# Altium schematic sheet 3_Cambridge_Measurement_TOP.SchDoc: Perovskite Solar Cells Analyzer
size 420 x 297 mm; CheckedBy: -; CompanyName: PoliSpace; DrawnBy: Daidone Luca; Organization: PoliSpace; Address1: Politecnico di Milano; Revision: -; SheetNumber: 1; SheetTotal: 1; Projet: 6S CubeSat - Payload; ModifiedBy: -; CreateDate: XX/XX/XXXX; CheckedDate: -; Title2: Circuit; DivGrp: EPS; Designer: Daidone Luca; ModifiedDate: -
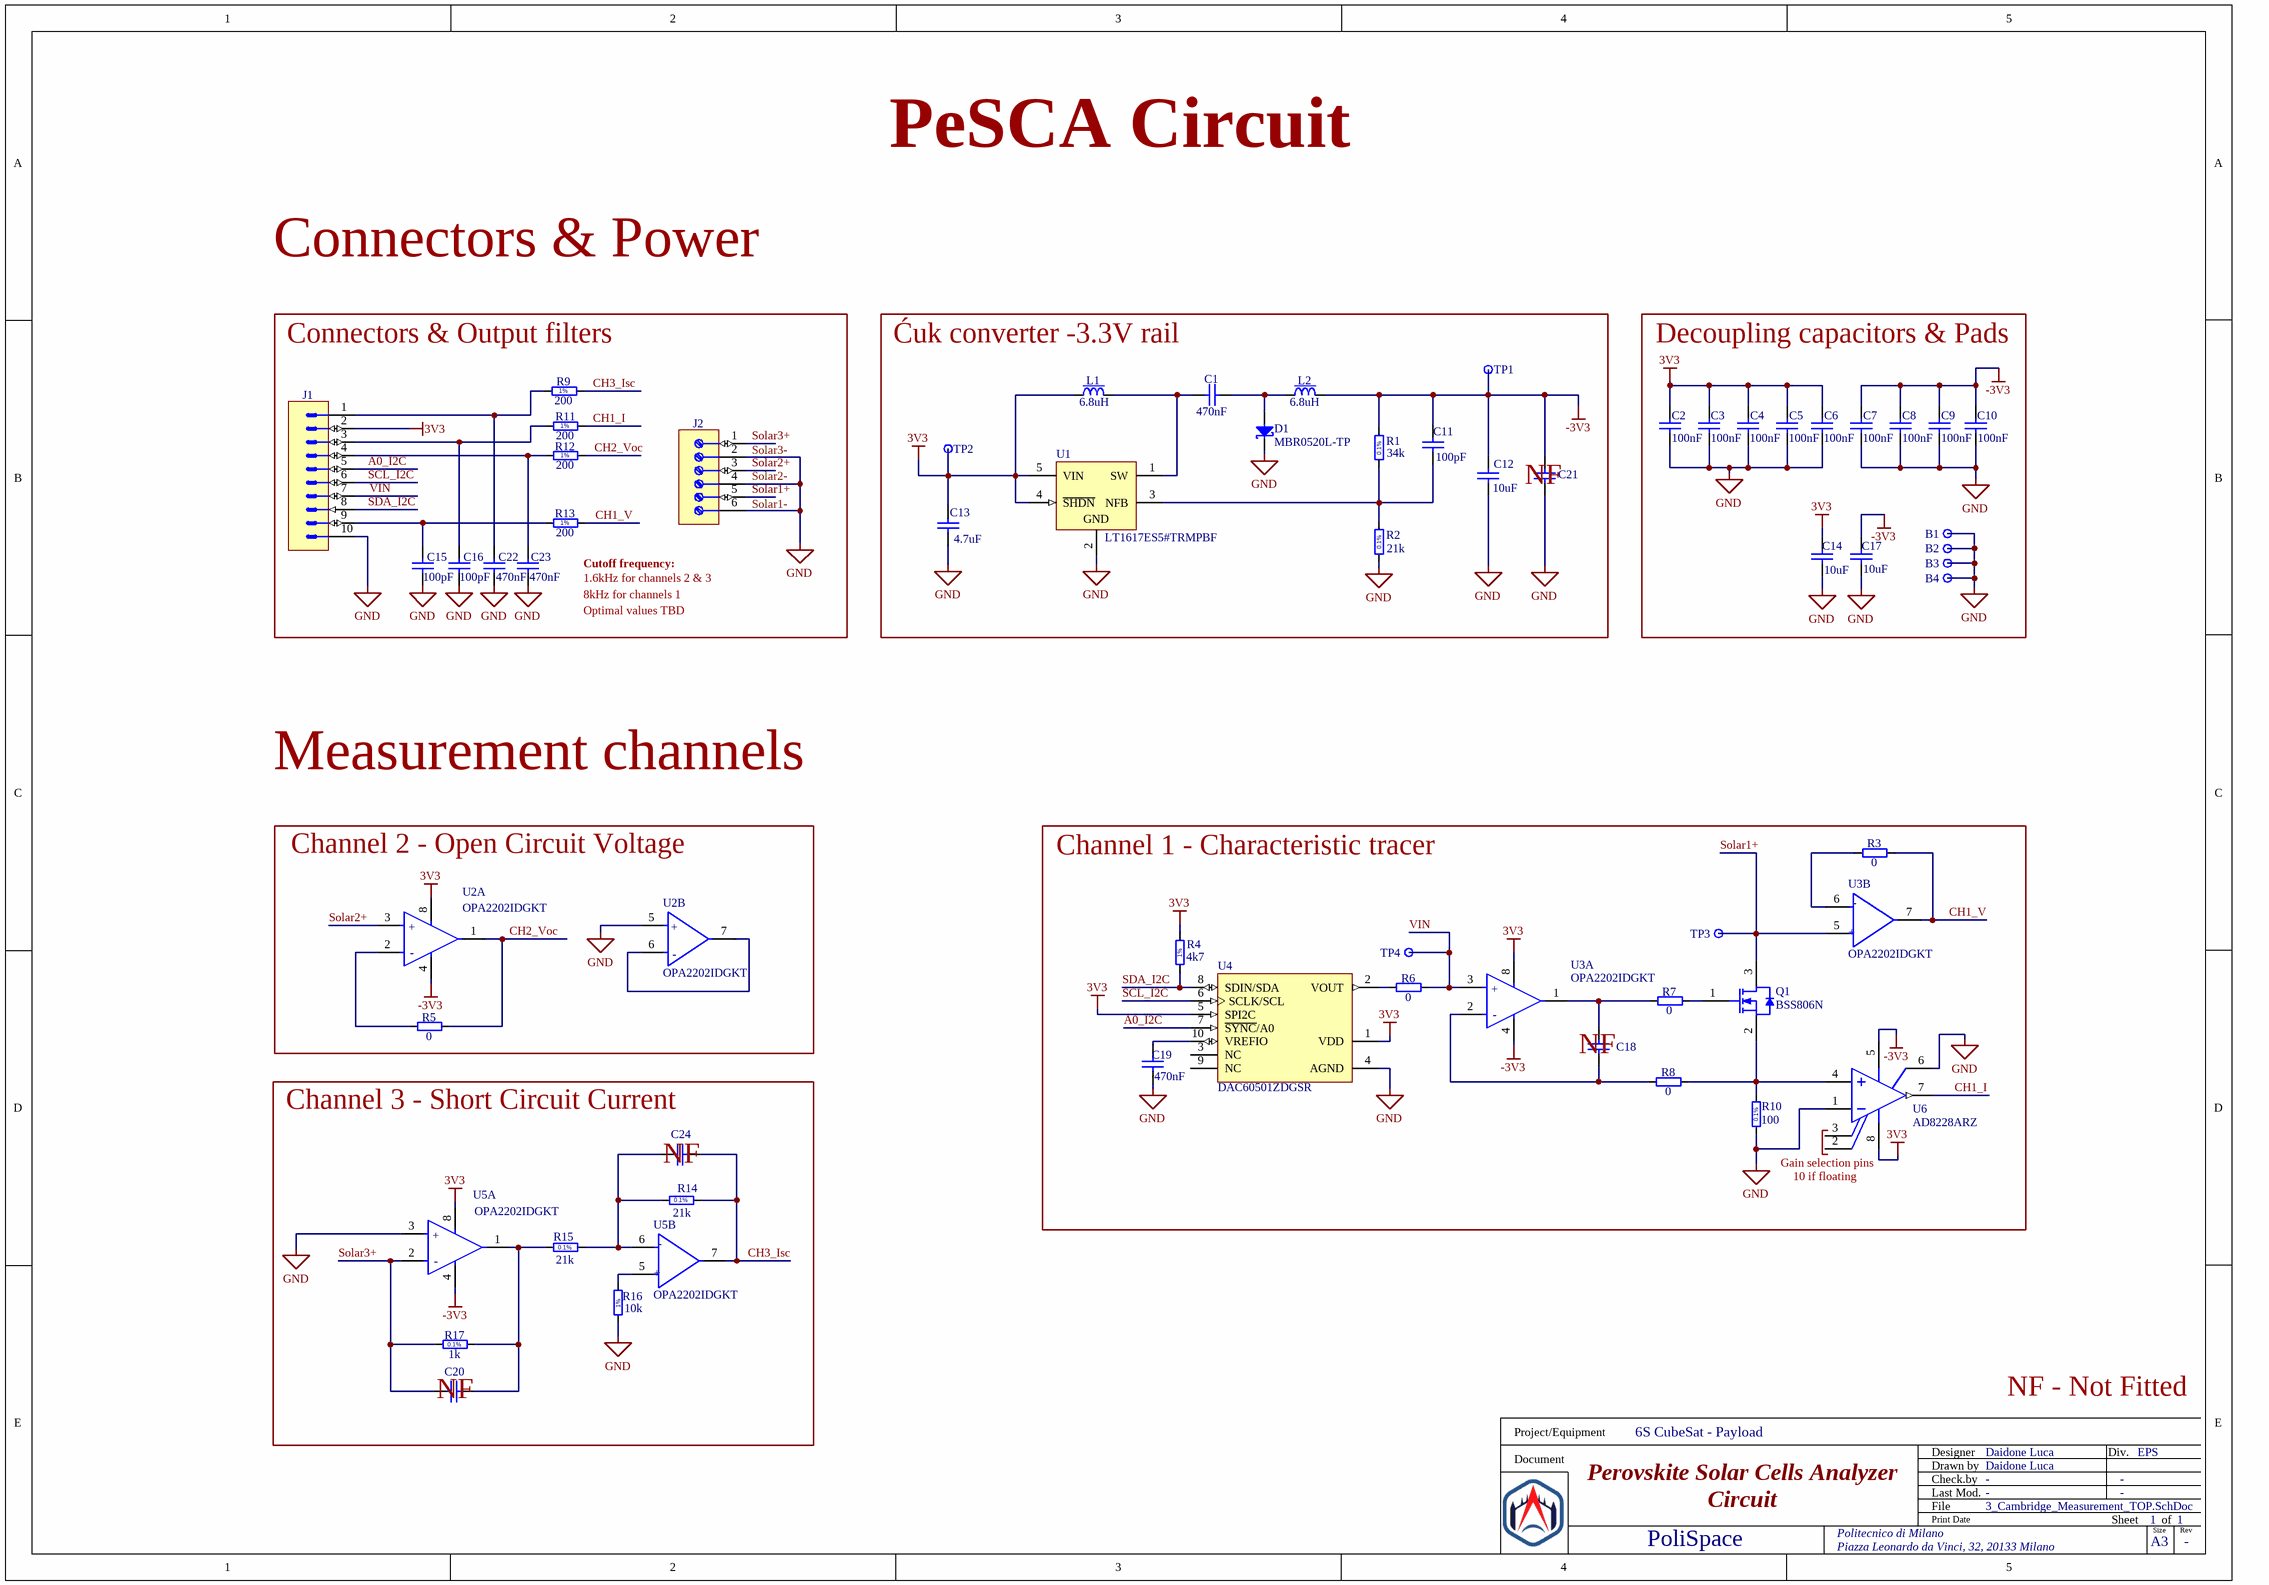
[diagram p0: 3_Cambridge_Measurement_TOP.SchDoc]

## Parts
B1  Plated Hole  [MTG350_650]  (value not drawn)  (no BOM)
B2  Plated Hole  [MTG350_650]  (value not drawn)  (no BOM)
B3  Plated Hole  [MTG350_650]  (value not drawn)  (no BOM)
B4  Plated Hole  [MTG350_650]  (value not drawn)  (no BOM)
C1  470nF  [CAPC1608X87N]
C2  100nF  [CAPC1608X87N]
C3  100nF  [CAPC1608X87N]
C4  100nF  [CAPC1608X87N]
C5  100nF  [CAPC1608X87N]
C6  100nF  [CAPC1608X87N]
C7  100nF  [CAPC1608X87N]
C8  100nF  [CAPC1608X87N]
C9  100nF  [CAPC1608X87N]
C10  100nF  [CAPC1608X87N]
C11  100pF  [CAPC1608X87N]
C12  10uF  [CAPC1608X80N]
C13  4.7uF  [CAPC1709X95N]
C14  10uF  [CAPC1608X80N]
C15  100pF  [CAPC1608X87N]
C16  100pF  [CAPC1608X87N]
C17  10uF  [CAPC1608X80N]
C18  100nF  [CAPC1608X87N]  (value not drawn)
C19  470nF  [CAPC1608X87N]
C20  100nF  [CAPC1608X87N]  (value not drawn)
C21  10uF  [CAPC2012X135N]  (value not drawn)
C22  470nF  [CAPC1608X87N]
C23  470nF  [CAPC1608X87N]
C24  100nF  [CAPC1608X87N]  (value not drawn)
D1  MBR0520L-TP  [SOD3715X135N]
J1  Header 10  [HARWIN_M20-9980546]  (value not drawn)
J2  (no value)  [PHOENIX_1725698]
L1  6.8uH  [IND_TDK_VLCF5020-1]
L2  6.8uH  [IND_TDK_VLCF5020-1]
Q1  BSS806N  [INF-PG-SOT23_M]
R1  34k  [RESC1608X55N]
R2  21k  [RESC1608X55N]
R3  0  [RESC1608X55N]
R4  4k7  [RESC1608X55N]
R5  0  [RESC1608X55N]
R6  0  [RESC1608X55N]
R7  0  [RESC1608X55N]
R8  0  [RESC1608X55N]
R9  200  [RESC1608X55N]
R10  100  [RESC1608X55N]
R11  200  [RESC1608X55N]
R12  200  [RESC1608X55N]
R13  200  [RESC1608X55N]
R14  21k  [RESC1608X55N]
R15  21k  [RESC1608X55N]
R16  10k  [RESC1608X55N]
R17  1k  [RESC1608X55N]
TP1  Test Point  [TPS127]  (value not drawn)
TP2  Test Point  [TPS127]  (value not drawn)
TP3  Test Point  [TPS127]  (value not drawn)
TP4  Test Point  [TPS127]  (value not drawn)
U1  LT1617ES5#TRMPBF  [LT-S5-5-SOT-23_L]
U2  OPA2202IDGKT  [FP-DGK0008A-IPC_A]  (parts A,B of 2)
U3  OPA2202IDGKT  [FP-DGK0008A-IPC_A]  (parts A,B of 2)
U4  DAC60501ZDGSR  [SOP50P490X110-10N]
U5  OPA2202IDGKT  [FP-DGK0008A-IPC_A]  (parts A,B of 2)
U6  AD8228ARZ  [ADI-R-8_L]

## Blocks framed on the sheet
Connectors & Output filters: C15 C16 C22 C23 J1 J2 R9 R11-R13
Decoupling capacitors & Pads: B1-B4 C2-C10 C14 C17
Channel 2 - Open Circuit Voltage: R5 U2

## Nets
3V3: C2.2 C3.2 C4.2 C5.2 C6.2 C13.2 C14.2 J1.2 L1.1 R4.2 TP2.1 U1.4(~{SHDN}) U1.5(VIN) U2.8(V+) U3.8(V+) U4.1(VDD) U4.5(SPI2C) U5.8(V+) U6.8(VS+)
-3V3: C7.2 C8.2 C9.2 C10.2 C11.2 C12.2 C17.2 C21.2 L2.2 R1.2 TP1.1 U2.4(V-) U3.4(V-) U5.4(V-) U6.5(VS-)
GND: B1.1 B2.1 B3.1 B4.1 C2.1 C3.1 C4.1 C5.1 C6.1 C7.1 C8.1 C9.1 C10.1 C12.1 C13.1 C14.1 C15.1 C16.1 C17.1 C19.2 C21.1 C22.1 C23.1 D1.1(C) J1.10 J2.2 J2.4 J2.6 R2.1 R10.1 R16.1 U1.2(GND) U2.5(+IN_B) U4.4(AGND) U5.3(+IN_A) U6.1(IN-) U6.6(REF)
A0_I2C: J1.5 U4.7(~{SYNC}/A0)
CH1_I: R11.2 U6.7(VOUT)
CH1_V: R3.2 R13.2 U3.7(OUT_B)
CH2_Voc: R5.2 R12.2 U2.1(OUT_A)
CH3_Isc: C24.1 R9.2 R14.2 U5.7(OUT_B)
SCL_I2C: J1.6 U4.6(SCLK/SCL)
SDA_I2C: J1.8 R4.1 U4.8(SDIN/SDA)
Solar1+: J2.5 Q1.3(DRAIN) TP3.1 U3.5(+IN_B)
Solar2+: J2.3 U2.3(+IN_A)
Solar3+: C20.2 J2.1 R17.1 U5.2(-IN_A)
VIN: J1.7 R6.2 TP4.1 U3.3(+IN_A)
NetC1_1: C1.1 L1.2 U1.1(SW)
NetC1_2: C1.2 D1.2(A) L2.1
NetC11_1: C11.1 R1.1 R2.2 U1.3(NFB)
NetC15_2: C15.2 J1.9 R13.1
NetC16_2: C16.2 J1.3 R11.1
NetC18_1: C18.1 R8.1 U3.2(-IN_A)
NetC18_2: C18.2 R7.1 U3.1(OUT_A)
NetC19_1: C19.1 U4.10(VREFIO)
NetC20_1: C20.1 R15.1 R17.2 U5.1(OUT_A)
NetC22_2: C22.2 J1.1 R9.1
NetC23_2: C23.2 J1.4 R12.1
NetC24_2: C24.2 R14.1 R15.2 U5.6(-IN_B)
NetQ1_1: Q1.1(GATE) R7.2
NetQ1_2: Q1.2(SOURCE) R8.2 R10.2 U6.4(IN+)
NetR3_1: R3.1 U3.6(-IN_B)
NetR5_1: R5.1 U2.2(-IN_A)
NetR6_1: R6.1 U4.2(VOUT)
NetR16_2: R16.2 U5.5(+IN_B)
NetU2_6: U2.6(-IN_B) U2.7(OUT_B)

Not connected (* = marked no-connect by the designer): U4 3(NC) 9(NC); U6 2(G1) 3(G2)

## Notes on the sheet
- PeSCA Circuit
- Connectors & Power
- Ćuk converter -3.3V rail
- (near J2) Solar3-
- (near J2) Solar2-
- (near J2) Solar1-
- (near C21) NF
- Cutoff frequency:
- 1.6kHz for channels 2 & 3
- 8kHz for channels 1
- Optimal values TBD
- Measurement channels
- Channel 1 - Characteristic tracer
- (near C18) NF
- Channel 3 - Short Circuit Current
- (near C24) NF
- (near U6) Gain selection pins
- (near U6) 10 if floating
- (near C20) NF
- NF - Not Fitted
- Project/Equipment
- Document
- Designer
- Drawn by
- Check.by
- Div.
- EPS
- PoliSpace
- Politecnico di Milano
- File
- Last Mod.
- Print Date
- Sheet
- Size
- A3
- of
- Rev
- Piazza Leonardo da Vinci, 32, 20133 Milano
- (in symbol CMP-04895-000300-1, part A) +; -
- (in symbol CMP-04895-000300-1, part B) +; -
- (in symbol R0603_1K_0.1%_0.063W_10PPM) 0.1%
- (in symbol R0603_4K7_1%_0.1W_100PPM) 1%
- (in symbol R0603_10K_1%_0.1W_100PPM) 1%
- (in symbol R0603_21K_0.1%_0.063W_10PPM) 0.1%
- (in symbol R0603_34K_0.1%_0.063W_10PPM) 0.1%
- (in symbol R0603_100R_0.1%_0.063W_10PPM) 0.1%
- (in symbol R0603_200R_1%_0.1W_100PPM) 1%

## Library data of the parts
B1-B4 = PLATED_HOLE3.5_PAD6.5: Single Terminal Socket; Part Description: Plated Through Hole: Hole Dia.=3.5mm Pad Dia.=6.5mm; Mounted: No; Part Number: PLATED_HOLE3.5_PAD6.5; Component Type: Standard (No BOM); Pin Count: 1; Family: Plated Hole; Socket: No; SMD: No; Sense: No; Status: None; ComponentHeight: 0mm; HelpURL: Undefined; Author: CERN DEM JLC; CreateDate: 20-Nov-08; LatestRevisionDate: 23-Nov-11; PackageDescription: Plated Through Hole: Hole Dia.=3.5mm Pad Dia.=6.5mm
C1 C19 C22 C23 = CC0603_470NF_50V_10%_X5R: Non-polarised capacitor; Part Description: SMD Multilayer Chip Ceramic Capacitor; Manufacturer: GENERIC; Manufacturer1 Part Number: C1608X5R1H474K080; Voltage: 50V; TC: X5R; Tolerance: ±10%; Part Number: CC0603_470NF_50V_10%_X5R; Component Kind: Standard; Component Type: Standard; Pin Count: 2; Value: 470nF; Status: None; Manufacturer Part Number: CC0603_470NF_50V_10%_X5R; Case: 0603; Mounted: Yes; Socket: No; SMD: Yes; Sense: No; Manufacturer1 Example: TDK; Manufacturer1 ComponentHeight: 0.9mm; HelpURL: \\cern.ch\dfs\Applications\Altium\Datasheets\CC0603_X5R_TDK_C.pdf; Author: CERN DEM MR; CreateDate: 29-Feb-16; LatestRevisionDate: 29-Feb-16
C2-C10 C18 C20 C24 = CC0603_100NF_50V_10%_X7R: Non-polarised capacitor; Part Description: SMD Multilayer Chip Ceramic Capacitor; Manufacturer: GENERIC; Manufacturer1 Part Number: 223858615649; Voltage: 50V; TC: X7R; Tolerance: ±10%; Part Number: CC0603_100NF_50V_10%_X7R; Component Kind: Standard; Component Type: Standard; Pin Count: 2; Value: 100nF; Status: Preferred; Manufacturer Part Number: CC0603_100NF_50V_10%_X7R; Case: 0603; Mounted: Yes; Socket: No; SMD: Yes; Sense: No; Manufacturer1 Example: PHYCOMP; Manufacturer1 ComponentHeight: 0.87mm; HelpURL: \\cern.ch\dfs\Applications\Altium\Datasheets\CC0603_X7R_PHYCOMP.pdf; Author: CERN DEM JLC; CreateDate: 03-Dec-07; LatestRevisionDate: 03-Dec-07
C11 C15 C16 = CC0603_100PF_50V_10%_X7R: Non-polarised capacitor; Part Description: SMD Multilayer Chip Ceramic Capacitor; Manufacturer: GENERIC; Manufacturer1 Part Number: 223858615609; Voltage: 50V; TC: X7R; Tolerance: ±10%; Part Number: CC0603_100PF_50V_10%_X7R; Component Kind: Standard; Component Type: Standard; Pin Count: 2; Value: 100pF; Status: Preferred; Manufacturer Part Number: CC0603_100PF_50V_10%_X7R; Case: 0603; Mounted: Yes; Socket: No; SMD: Yes; Sense: No; Manufacturer1 Example: PHYCOMP; Manufacturer1 ComponentHeight: 0.9mm; HelpURL: \\cern.ch\dfs\Applications\Altium\Datasheets\CC0603_X7R_PHYCOMP.pdf; Author: CERN DEM JLC; CreateDate: 15-Aug-12; LatestRevisionDate: 15-Aug-12
C12 C14 C17 = CC0603_10UF_16V_20%_X5R: Non-polarised capacitor; Part Description: SMD Multilayer Chip Ceramic Capacitor; Manufacturer: GENERIC; Manufacturer1 Part Number: GRM188R61C106MA73D; Voltage: 16V; TC: X5R; Tolerance: ±20%; Part Number: CC0603_10UF_16V_20%_X5R; Component Kind: Standard; Component Type: Standard; Pin Count: 2; Value: 10uF; Status: None; Manufacturer Part Number: CC0603_10UF_16V_20%_X5R; Case: 0603; Mounted: Yes; Socket: No; SMD: Yes; Sense: No; Manufacturer1 Example: MURATA; Manufacturer1 ComponentHeight: 0.8mm; HelpURL: \\cern.ch\dfs\Applications\Altium\Datasheets\CC0603_X5R_MURATA_GRM.pdf; Author: CERN DEM MR; CreateDate: 02-Mar-16; LatestRevisionDate: 02-Mar-16
C13 = CC0603_4.7UF_16V_10%_X5R: Non-polarised capacitor; Part Description: SMD Multilayer Chip Ceramic Capacitor; Manufacturer: GENERIC; Manufacturer1 Part Number: EMK107ABJ475KA-T; Voltage: 16V; TC: X5R; Tolerance: ±10%; Part Number: CC0603_4.7UF_16V_10%_X5R; Component Kind: Standard; Component Type: Standard; Pin Count: 2; Value: 4.7uF; Status: None; Manufacturer Part Number: CC0603_4.7UF_16V_10%_X5R; Case: 0603; Mounted: Yes; Socket: No; SMD: Yes; Sense: No; Manufacturer1 Example: TAIYO YUDEN; Manufacturer1 ComponentHeight: 0.95mm; HelpURL: \\cern.ch\dfs\Applications\Altium\Datasheets\CC0603_X7R_TAIYO-YUDEN_HIGH-VALUE.pdf; Author: CERN DEM JLC; CreateDate: 16-Dec-13; LatestRevisionDate: 16-Sep-14
C21 = CC0805_10UF_16V_10%_X5R: Non-polarised capacitor; Part Description: SMD Multilayer Chip Ceramic Capacitor; Manufacturer: GENERIC; Manufacturer1 Part Number: C0805C106K4PAC; Voltage: 16V; TC: X5R; Tolerance: ±10%; Part Number: CC0805_10UF_16V_10%_X5R; Component Kind: Standard; Component Type: Standard; Pin Count: 2; Value: 10uF; Status: Preferred; Manufacturer Part Number: CC0805_10UF_16V_10%_X5R; Case: 0805; Mounted: Yes; Socket: No; SMD: Yes; Sense: No; Manufacturer1 Example: KEMET; Manufacturer1 ComponentHeight: 1.4mm; HelpURL: \\cern.ch\dfs\Applications\Altium\Datasheets\CC1206_X5R_KEMET.pdf; Author: CERN DEM JLC; CreateDate: 03-Dec-07; LatestRevisionDate: 03-Dec-07
D1 = MBR0520L-TP: Diode Schottky 20V 0.5A 2-Pin SOD-123 T/R; Manufacturer: MCC; Manufacturer Part Number: MBR0520-TP; Forward Voltage: 450mV; Max Reverse Current: 200uA; Average Rectified Current: 500mA; Max Forward Surge Current (Ifsm): 5.5A; Element Configuration: Single; Polarity: Standard; Capacitance: 30pF; Supplier 1: Future Electronics; RoHS: Yes; Category: Schottky Diodes; Stock 1: 3000; Pricing 1: 3000=0.06080, 9000=0.05070, 15000=0.05020, 45000=0.04910, 75000=0.04860 (USD); Mount: Surface Mount; Number of Pins: 2; Min Operating Temperature: -55°C; Max Operating Temperature: 150°C; Packaging: Tape and Reel; Package Quantity: 1; Max Repetitive Reverse Voltage (Vrrm): 20V; Max Reverse Voltage (DC): 20V; Forward Current: 500mA; Peak Non-Repetitive Surge Current: 5.5A; Voltage Rating (DC): 20V; Current Rating: 500mA; Output Current: 500mA; Series: MBR0520; Radiation Hardening: No; Lead Free: Lead Free; RoHS Compliant: Yes; REACH SVHC: Unknown; ComponentLink1URL: https://datasheet.ciiva.com/23684/1699590-23684328.pdf?src-supplier=Newark; ComponentLink1Description: https://datasheet.ciiva.com/23684/1699590-23684328.pdf?src-supplier=Newark; ComponentLink2URL: https://datasheet.ciiva.com/15200/getdatasheetpartid-202300-15200502.pdf?src-supplier=Verical; ComponentLink2Description: https://datasheet.ciiva.com/15200/getdatasheetpartid-202300-15200502.pdf?src-supplier=Verical; ComponentLink3URL: https://datasheet.ciiva.com/912/mbr0520mbr0580sod123-912327.pdf?src-supplier=Digi-Key; ComponentLink3Description: https://datasheet.ciiva.com/912/mbr0520mbr0580sod123-912327.pdf?src-supplier=Digi-Key; ComponentLink4URL: https://datasheet.ciiva.com/912/mbr0520mbr0580sod123-912328.pdf?src-supplier=Digi-Key; ComponentLink4Description: https://datasheet.ciiva.com/912/mbr0520mbr0580sod123-912328.pdf?src-supplier=Digi-Key; ComponentLink5URL: https://datasheet.ciiva.com/912/mbr0520mbr0580sod123-912329.pdf?src-supplier=Digi-Key; ComponentLink5Description: https://datasheet.ciiva.com/912/mbr0520mbr0580sod123-912329.pdf?src-supplier=Digi-Key; ComponentLink6URL: https://datasheet.ciiva.com/7963/1699590-7963290.pdf?src-supplier=Element14; ComponentLink6Description: https://datasheet.ciiva.com/7963/1699590-7963290.pdf?src-supplier=Element14; ComponentLink7URL: https://datasheet.ciiva.com/28381/1699590-28381979.pdf?src-supplier=Element14; ComponentLink7Description: https://datasheet.ciiva.com/28381/1699590-28381979.pdf?src-supplier=Element14; Supplier Part Number 1: 7013061
J1 = HARWIN_M20-9980546: Connector 10 Male; Part Description: 10 Contacts - Pitch 2.54mm - Dual Row Straight Header (Lead Length 6.1mm, Insulator 2.54mm); Manufacturer: HARWIN; PressFit: No; Part Number: HARWIN_M20-9980546; Component Kind: Standard; Component Type: Standard; Pin Count: 10; Family: Header 10; Mounted: Yes; Socket: No; SMD: No; Sense: No; Status: None; Manufacturer Part Number: M20-9980546; ComponentHeight: 8.64mm; HelpURL: \\cern.ch\dfs\Applications\Altium\Datasheets\HARWIN_M20-9980546.pdf; Author: CERN DEM MR; CreateDate: 15-Sep-17; LatestRevisionDate: 15-Sep-17
J2 = PHOENIX_1725698: Terminal Block, 6 Positions, Screw Connection; Part Description: 6A, 63V, Terminal Block, Pitch 2.54mm, 6 Positions, Screw Connection; Manufacturer: PHOENIX CONTACT; Manufacturer Part Number: 1725698 (MPT 0,5/6-2,54); PressFit: No; Part Number: PHOENIX_1725698; Component Kind: Standard; Component Type: Standard; Pin Count: 6; Mounted: Yes; Socket: No; SMD: No; Sense: No; Status: None; ComponentHeight: 8.5mm; HelpURL: \\cern.ch\dfs\Applications\Altium\Datasheets\PHOENIX_1725698.pdf; Author: CERN DEM JMW; CreateDate: 07-Nov-08; LatestRevisionDate: 26-Apr-10
L1 L2 = IND_10UH_20%_TDK_VLCF5020-1: Inductor With Core; Part Description: SMD Inductor for Power Circuits (Wound/STD , Magnetic Shielded), VLCF series; Manufacturer: TDK; Manufacturer Part Number: VLCF5020T-100M1R1-1; Value: 10uH; Power: 1.5A; Resistance: 0.198R; Tolerance: ±20%; Part Number: IND_10UH_20%_TDK_VLCF5020-1; Component Kind: Standard; Component Type: Standard; Pin Count: 2; Status: None; Mounted: Yes; Socket: No; SMD: Yes; Sense: No; ComponentHeight: 2mm; HelpURL: \\cern.ch\dfs\Applications\Altium\Datasheets\IND_TDK_VLCF.pdf; Author: CERN DEM JLC; CreateDate: 10-Jul-14; LatestRevisionDate: 10-Jul-14
Q1 = CMP-1149-00036-1: N-Channel OptiMOS 2 Small-Signal-Transistor, 20 V VDS, 2.3 A ID, -55 to 150 degC, PG-SOT23, Reel, Green; Manufacturer: Infineon; VDS (max): 20 V; RthJA (max): 250 K/W; VGS(th) (max): 0.75Â V; QG: 1.7Â nC; RDS (on) (max) (@2.5V): 57 mOhm; VGS(th) (min): 0.3Â V; Ptot (max): 0.5Â W; Green: TRUE; IDpuls (max): 9.3Â A; ID (max): 2.3Â A; RDS (on) (max) (@1.8V): 82 mOhm; Halogen-free: TRUE; PackageVersion: Apr-08; PackageReference: PG-SOT23; PackageDescription: 3-Pin Small Outline Transistor Package, 2.9 x 1.3 mm Body, 0.95 mm Pitch; ComponentLink3URL: http://www.infineon.com/dgdl/SOT23-Package_Overview.pdf?folderId=db3a30431936bc4b0119532290053c66&fileId=db3a30431936bc4b0119533468123c85; ComponentLink3Description: Package Specification; ComponentLink2Description: Datasheet; Packing: Reel; Mounting Technology: Surface Mount; PartNumber: BSS806N; RDS (on) (max): 57 mOhm; ComponentLink2URL: http://www.infineon.com/dgdl/BSS806N_Rev2.3_.pdf?folderId=db3a3043156fd573011622e10b5c1f67&fileId=db3a304330f686060131185f0553451c; ComponentLink1URL: http://www.infineon.com/; ComponentLink1Description: Manufacturer URL; DatasheetVersion: Rev. 2.3
R1 = R0603_34K_0.1%_0.063W_10PPM: Resistor - 0.1%; Part Description: Thin Film Chip Resistor; Manufacturer: GENERIC; Manufacturer1 Part Number: RN73C1J34KBTDF; Power: 0.063W; TC: ±10ppm; PressFit: No; Part Number: R0603_34K_0.1%_0.063W_10PPM; Component Kind: Standard; Component Type: Standard; Pin Count: 2; Value: 34k; Status: Not Recommended; Tolerance: ±0.1%; Manufacturer Part Number: R0603_34K_0.1%_0.063W_10PPM; Case: 0603; Mounted: Yes; Sense: No; Socket: No; SMD: Yes; Manufacturer1 Example: TYCO HOLSWORTHY; Manufacturer1 ComponentHeight: 0.5mm; HelpURL: \\cern.ch\dfs\Applications\Altium\Datasheets\R0603_Tyco_RN73.pdf; Author: CERN DEM JLC; CreateDate: 03-Dec-07; LatestRevisionDate: 13-Mar-08
R2 R14 R15 = R0603_21K_0.1%_0.063W_10PPM: Resistor - 0.1%; Part Description: Thin Film Chip Resistor; Manufacturer: GENERIC; Manufacturer1 Part Number: RN73C1J21KBTDF; Power: 0.063W; TC: ±10ppm; PressFit: No; Part Number: R0603_21K_0.1%_0.063W_10PPM; Component Kind: Standard; Component Type: Standard; Pin Count: 2; Value: 21k; Status: Not Recommended; Tolerance: ±0.1%; Manufacturer Part Number: R0603_21K_0.1%_0.063W_10PPM; Case: 0603; Mounted: Yes; Sense: No; Socket: No; SMD: Yes; Manufacturer1 Example: TYCO HOLSWORTHY; Manufacturer1 ComponentHeight: 0.5mm; HelpURL: \\cern.ch\dfs\Applications\Altium\Datasheets\R0603_Tyco_RN73.pdf; Author: CERN DEM JLC; CreateDate: 03-Dec-07; LatestRevisionDate: 13-Mar-08
R3 R5-R8 = R0603_0R_JUMPER: Resistor; Part Description: 1A (0.05R Max DC Resistance) Zero Ohm Jumper; Manufacturer: GENERIC; Manufacturer1 Part Number: NRC06Z0; PressFit: No; Part Number: R0603_0R_JUMPER; Component Kind: Standard; Component Type: Standard; Pin Count: 2; Value: 0; Status: Preferred; Manufacturer Part Number: R0603_0R_JUMPER; Case: 0603; Mounted: Yes; Sense: No; Socket: No; SMD: Yes; Manufacturer1 Example: NIC COMPONENT; Manufacturer1 ComponentHeight: 0.55mm; HelpURL: \\cern.ch\dfs\Applications\Altium\Datasheets\R0603_NIC_NRC.pdf; Author: CERN DEM JLC; CreateDate: 03-Dec-07; LatestRevisionDate: 13-Mar-08
R4 = R0603_4K7_1%_0.1W_100PPM: Resistor - 1%; Part Description: General Purpose Thick Film Chip Resistor; Manufacturer: GENERIC; Manufacturer1 Part Number: NRC06F4701TRF; Power: 0.1W; TC: ±100ppm/°C; PressFit: No; Part Number: R0603_4K7_1%_0.1W_100PPM; Component Kind: Standard; Component Type: Standard; Pin Count: 2; Value: 4k7; Status: Preferred; Tolerance: ±1%; Manufacturer Part Number: R0603_4K7_1%_0.1W_100PPM; Case: 0603; Mounted: Yes; Sense: No; Socket: No; SMD: Yes; Manufacturer1 Example: NIC COMPONENT; Manufacturer1 ComponentHeight: 0.55mm; HelpURL: \\cern.ch\dfs\Applications\Altium\Datasheets\R0603_NIC_NRC.pdf; Author: CERN DEM JLC; CreateDate: 03-Dec-07; LatestRevisionDate: 13-Mar-08
R9 R11-R13 = R0603_200R_1%_0.1W_100PPM: Resistor - 1%; Part Description: General Purpose Thick Film Chip Resistor; Manufacturer: GENERIC; Manufacturer1 Part Number: NRC06F2000TRF; Power: 0.1W; TC: ±100ppm/°C; PressFit: No; Part Number: R0603_200R_1%_0.1W_100PPM; Component Kind: Standard; Component Type: Standard; Pin Count: 2; Value: 200; Status: Preferred; Tolerance: ±1%; Manufacturer Part Number: R0603_200R_1%_0.1W_100PPM; Case: 0603; Mounted: Yes; Sense: No; Socket: No; SMD: Yes; Manufacturer1 Example: NIC COMPONENT; Manufacturer1 ComponentHeight: 0.55mm; HelpURL: \\cern.ch\dfs\Applications\Altium\Datasheets\R0603_NIC_NRC.pdf; Author: CERN DEM JLC; CreateDate: 03-Dec-07; LatestRevisionDate: 13-Mar-08
R10 = R0603_100R_0.1%_0.063W_10PPM: Resistor - 0.1%; Part Description: Thin Film Chip Resistor; Manufacturer: GENERIC; Manufacturer1 Part Number: RN73C1J100RBTDF; Power: 0.063W; TC: ±10ppm; PressFit: No; Part Number: R0603_100R_0.1%_0.063W_10PPM; Component Kind: Standard; Component Type: Standard; Pin Count: 2; Value: 100; Status: Not Recommended; Tolerance: ±0.1%; Manufacturer Part Number: R0603_100R_0.1%_0.063W_10PPM; Case: 0603; Mounted: Yes; Sense: No; Socket: No; SMD: Yes; Manufacturer1 Example: TYCO HOLSWORTHY; Manufacturer1 ComponentHeight: 0.5mm; HelpURL: \\cern.ch\dfs\Applications\Altium\Datasheets\R0603_Tyco_RN73.pdf; Author: CERN DEM JLC; CreateDate: 03-Dec-07; LatestRevisionDate: 13-Mar-08
R16 = R0603_10K_1%_0.1W_100PPM: Resistor - 1%; Part Description: General Purpose Thick Film Chip Resistor; Manufacturer: GENERIC; Manufacturer1 Part Number: NRC06F1002TRF; Power: 0.1W; TC: ±100ppm/°C; PressFit: No; Part Number: R0603_10K_1%_0.1W_100PPM; Component Kind: Standard; Component Type: Standard; Pin Count: 2; Value: 10k; Status: Preferred; Tolerance: ±1%; Manufacturer Part Number: R0603_10K_1%_0.1W_100PPM; Case: 0603; Mounted: Yes; Sense: No; Socket: No; SMD: Yes; Manufacturer1 Example: NIC COMPONENT; Manufacturer1 ComponentHeight: 0.55mm; HelpURL: \\cern.ch\dfs\Applications\Altium\Datasheets\R0603_NIC_NRC.pdf; Author: CERN DEM JLC; CreateDate: 03-Dec-07; LatestRevisionDate: 13-Mar-08
R17 = R0603_1K_0.1%_0.063W_10PPM: Resistor - 0.1%; Part Description: Thin Film Chip Resistor; Manufacturer: GENERIC; Manufacturer1 Part Number: RN73C1J1K0BTG; Power: 0.063W; TC: ±10ppm; PressFit: No; Part Number: R0603_1K_0.1%_0.063W_10PPM; Component Kind: Standard; Component Type: Standard; Pin Count: 2; Value: 1k; Status: Not Recommended; Tolerance: ±0.1%; Manufacturer Part Number: R0603_1K_0.1%_0.063W_10PPM; Case: 0603; Mounted: Yes; Sense: No; Socket: No; SMD: Yes; Manufacturer1 Example: TYCO HOLSWORTHY; Manufacturer1 ComponentHeight: 0.55mm; HelpURL: \\cern.ch\dfs\Applications\Altium\Datasheets\R0603_Tyco_RN73.pdf; Author: CERN DEM BC; CreateDate: 23-May-16; LatestRevisionDate: 23-May-16
TP1-TP4 = SMD_PAD_1.27X1.27MM: Part Description: 1.27mm x 1.27mm PCB Copper Area (SMD Test Point); Mounted: No; Part Number: SMD_PAD_1.27X1.27MM; Component Kind: Standard (No BOM); Component Type: Standard (No BOM); Pin Count: 1; Family: Test Point; Socket: No; SMD: No; Sense: No; Status: None; ComponentHeight: 0mm; HelpURL: Undefined; Author: CERN DEM JLC; CreateDate: 12-Jan-08; LatestRevisionDate: 12-Jan-08; PackageDescription: 1.27mm x 1.27mm PCB Copper Area (SMD Test Point)
U1 = CMP-0491-01503-1: Micropower Inverting DC/DC Converter, 5-pin SOT23 (S5-5), -40 to 85 degC, Pb-Free, Mini Tape and Reel; Manufacturer: Linear Technology; Number of Outputs: 1; RoHS: TRUE; ComponentLink3URL: http://cds.linear.com/docs/en/datasheet/17278fb.pdf; ComponentLink2Description: Datasheet; PartNumber: LT1617ES5#TRMPBF; Packing: Mini Tape and Reel; PackageReference: S5-5; ComponentLink1URL: http://www.linear.com/; Mounting Technology: Surface Mount; PackageDescription: 5-Pin Plastic SOT-23, Body 1.625 x 2.90 mm, Pitch 0.95 mm; ComponentLink3Description: Package Specification; ComponentLink2URL: http://cds.linear.com/docs/en/datasheet/16171f.pdf; PackageVersion: Aug-07; ComponentLink1Description: Manufacturer URL
U2 U3 U5 = CMP-04895-000300-1: IC OPAMP GP 2 CIRCUIT 8VSSOP
U4 = DAC60501ZDGSR: 12-Bit Voltage Output DAC with Precision Internal Reference 1-LSB INL 10-Pin VSSOP T/R; Manufacturer: Texas Instruments; Supplier 1: Digi-Key; Manufacturer Part Number: DAC60501ZDGSR; RoHS: Yes; Category: Digital to Analog Converters (DACs); Stock 1: 238; Pricing 1: 1=2.86000, 10=2.57000, 25=2.42480, 100=2.06590, 250=1.93980, 500=1.69732, 1000=1.60125 (USD); RoHS Compliant: Yes; Supplier Part Number 1: 296-DAC60501ZDGSRCT-ND
U6 = CMP-0934-00050-1: Low Gain Drift Precision Instrumentation Amplifier, Single Supply 4.6 to 36 V, -40 to 125 degC, 8-Pin SOIC (R-8), RoHS, Tube; Manufacturer: Analog Devices; -3dB Bandwidth: 650 kHz Typ.; Quiescent Current: 0.85 mA Typ.; Slew Rate: 2.5 V/us Typ.; VIO: 90 uV Max.; ComponentLink2URL: http://www.analog.com/static/imported-files/data_sheets/AD8228.pdf; Mounting Technology: Surface Mount; RoHS: TRUE; PackageDescription: 8-Pin Small Outline Integrated Circuit, Body 4.9 x 3.9 mm, Pitch 1.27 mm; PartNumber: AD8228ARZ; ComponentLink3URL: http://www.analog.com/static/imported-files/packages/PKG_PDF/SOIC_Narrow%20(R)/R_8.pdf; ComponentLink3Description: Package Specification; ComponentLink1Description: Manufacturer URL; Packing: Tube; DatasheetVersion: Rev. 0; ComponentLink2Description: Datasheet; ComponentLink1URL: http://www.analog.com/en/index.html; VSS@Single Supply: 4.6 to 36 V; PackageVersion: Jun-06; Temperature Range: -40 to 125 degC